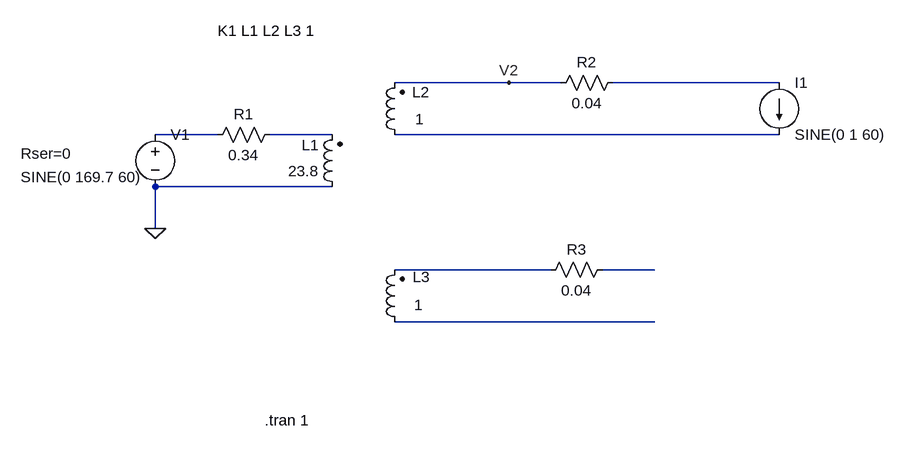
[diagram p0: schematic unloaded_transformer.asc]
unloaded_transformer.asc, the LTspice schematic file:
Version 4
SHEET 1 2164 680
WIRE 320 80 144 80
WIRE 400 80 320 80
WIRE 736 80 480 80
WIRE -128 160 -224 160
WIRE 48 160 -48 160
WIRE 736 160 144 160
WIRE 48 240 -224 240
WIRE -224 304 -224 240
WIRE 384 368 144 368
WIRE 544 368 464 368
WIRE 544 448 144 448
FLAG -224 304 0
FLAG 320 80 V2
SYMBOL ind2 64 256 R180
WINDOW 0 36 80 Left 2
WINDOW 3 36 40 Left 2
SYMATTR InstName L1
SYMATTR Value 23.8
SYMATTR Type ind
SYMATTR SpiceLine Rser=0
SYMBOL ind2 160 176 R180
WINDOW 0 -38 82 Left 2
WINDOW 3 -29 40 Left 2
SYMATTR InstName L2
SYMATTR Value 1
SYMATTR Type ind
SYMATTR SpiceLine Rser=0
SYMBOL voltage -224 144 R0
WINDOW 3 -207 81 Left 2
WINDOW 123 24 180 Left 2
WINDOW 39 -207 45 Left 2
SYMATTR Value SINE(0 169.7 60)
SYMATTR SpiceLine Rser=0
SYMATTR InstName V1
SYMBOL ind2 160 464 R180
WINDOW 0 -39 85 Left 2
WINDOW 3 -28 42 Left 2
SYMATTR InstName L3
SYMATTR Value 1
SYMATTR Type ind
SYMATTR SpiceLine Rser=0
SYMBOL res -32 144 R90
WINDOW 0 0 56 VBottom 2
WINDOW 3 32 56 VTop 2
SYMATTR InstName R1
SYMATTR Value 0.34
SYMBOL res 496 64 R90
WINDOW 0 0 56 VBottom 2
WINDOW 3 32 56 VTop 2
SYMATTR InstName R2
SYMATTR Value 0.04
SYMBOL res 480 352 R90
WINDOW 0 0 56 VBottom 2
WINDOW 3 32 56 VTop 2
SYMATTR InstName R3
SYMATTR Value 0.04
SYMBOL current 736 80 R0
WINDOW 123 0 0 Left 0
WINDOW 39 0 0 Left 0
SYMATTR InstName I1
SYMATTR Value SINE(0 1 60)
TEXT -128 0 Left 2 !K1 L1 L2 L3 1
TEXT -56 600 Left 2 !.tran 1

The netlist it stands for:
* unloaded_transformer.asc
L1 0 N003 23.8 Rser=0
L2 N004 V2 1 Rser=0
V1 N002 0 SINE(0 169.7 60) Rser=0
L3 N007 N005 1 Rser=0
R1 N003 N002 0.34
R2 N001 V2 0.04
R3 N006 N005 0.04
I1 N001 N004 SINE(0 1 60)
K1 L1 L2 L3 1
.tran 1
.backanno
.end